# Altium project 擂台机器人.PrjPcb
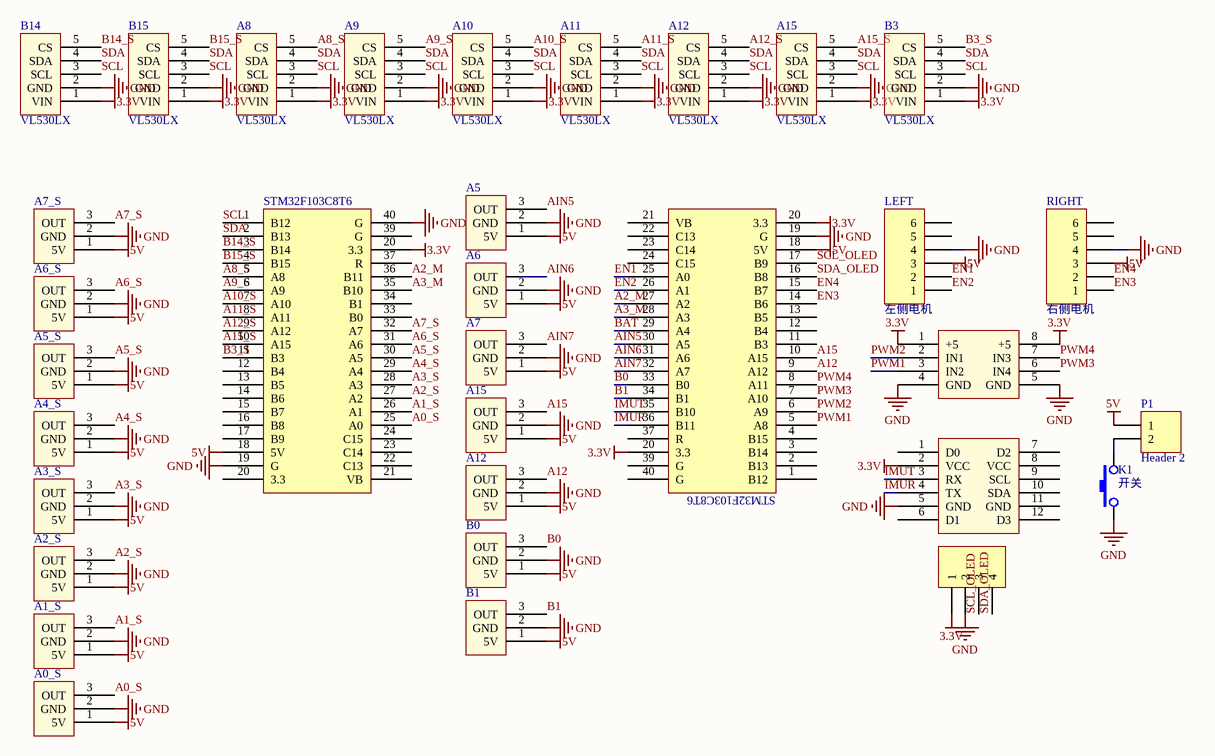
[diagram p0: 擂台机器人.SchDoc]
1 sheet, 33 parts. Net scope: global (net labels, ports and power ports of the same name join across sheets).
Board files: 擂台机器人V1.0.PcbDoc, PCB1.PcbDoc

## Sheet 擂台机器人.SchDoc
size A4

### Parts
(Parts that share a designator on the sheet are numbered #1, #2 ... from top to bottom, then left to right.)
A0_S  通用3PIN接线端子  [通用3pin插座]  (value not drawn)
A1_S  通用3PIN接线端子  [通用3pin插座]  (value not drawn)
A2_S  通用3PIN接线端子  [通用3pin插座]  (value not drawn)
A3_S  通用3PIN接线端子  [通用3pin插座]  (value not drawn)
A4_S  通用3PIN接线端子  [通用3pin插座]  (value not drawn)
A5  通用3PIN接线端子  [通用3pin插座]  (value not drawn)
A5_S  通用3PIN接线端子  [通用3pin插座]  (value not drawn)
A6  通用3PIN接线端子  [通用3pin插座]  (value not drawn)
A6_S  通用3PIN接线端子  [通用3pin插座]  (value not drawn)
A7  通用3PIN接线端子  [通用3pin插座]  (value not drawn)
A7_S  通用3PIN接线端子  [通用3pin插座]  (value not drawn)
A8  VL530LX  [VL53L0X]
A9  VL530LX  [VL53L0X]
A10  VL530LX  [VL53L0X]
A11  VL530LX  [VL53L0X]
A12#1  VL530LX  [VL53L0X]
A12#2  通用3PIN接线端子  [通用3pin插座]  (value not drawn)
A15#1  VL530LX  [VL53L0X]
A15#2  通用3PIN接线端子  [通用3pin插座]  (value not drawn)
B0  通用3PIN接线端子  [通用3pin插座]  (value not drawn)
B1  通用3PIN接线端子  [通用3pin插座]  (value not drawn)
B3  VL530LX  [VL53L0X]
B14  VL530LX  [VL53L0X]
B15  VL530LX  [VL53L0X]
C8T6最小系统  C8T6最小系统  [C8t6]  (value not drawn)
C8T6最小系统2  C8T6最小系统  [C8t6]  (value not drawn)
K1  开关  [船型开关 KCD1-11-2P]
LEFT  左侧电机  [HDR1X6]
OLED  OLED  [HDR1X4]  (value not drawn)
P1  Header 2  [接线端子 2]
RIGHT  右侧电机  [HDR1X6]
WT901  WT901  [WT901]  (value not drawn)
得科电机驱动  得科电机驱动  [得科电机驱动]  (value not drawn)

### Nets
3.3V: A8.1(VIN) A9.1(VIN) A10.1(VIN) A11.1(VIN) A12#1.1(VIN) A15#1.1(VIN) B3.1(VIN) B14.1(VIN) B15.1(VIN) C8T6最小系统.20(3.3) C8T6最小系统2.20(3.3) OLED.1 WT901.2(VCC) 得科电机驱动.1(+5) 得科电机驱动.8(+5)
5V: A0_S.1(5V) A1_S.1(5V) A2_S.1(5V) A3_S.1(5V) A4_S.1(5V) A5.1(5V) A5_S.1(5V) A6.1(5V) A6_S.1(5V) A7.1(5V) A7_S.1(5V) A12#2.1(5V) A15#2.1(5V) B0.1(5V) B1.1(5V) C8T6最小系统.18(5V) C8T6最小系统2.18(5V) LEFT.3 P1.1 RIGHT.3
GND: A0_S.2(GND) A1_S.2(GND) A2_S.2(GND) A3_S.2(GND) A4_S.2(GND) A5.2(GND) A5_S.2(GND) A6.2(GND) A6_S.2(GND) A7.2(GND) A7_S.2(GND) A8.2(GND) A9.2(GND) A10.2(GND) A11.2(GND) A12#1.2(GND) A12#2.2(GND) A15#1.2(GND) A15#2.2(GND) B0.2(GND) B1.2(GND) B3.2(GND) B14.2(GND) B15.2(GND) C8T6最小系统.19(G) C8T6最小系统2.19(G) C8T6最小系统2.40(G) K1.1 LEFT.4 OLED.2 RIGHT.4 WT901.5(GND) 得科电机驱动.4(GND) 得科电机驱动.5(GND)
A0_S: A0_S.3(OUT) C8T6最小系统2.25(A0)
A1_S: A1_S.3(OUT) C8T6最小系统2.26(A1)
A2_M: C8T6最小系统.27(A2) C8T6最小系统2.36(B11)
A2_S: A2_S.3(OUT) C8T6最小系统2.27(A2)
A3_M: C8T6最小系统.28(A3) C8T6最小系统2.35(B10)
A3_S: A3_S.3(OUT) C8T6最小系统2.28(A3)
A4_S: A4_S.3(OUT) C8T6最小系统2.29(A4)
A5_S: A5_S.3(OUT) C8T6最小系统2.30(A5)
A6_S: A6_S.3(OUT) C8T6最小系统2.31(A6)
A7_S: A7_S.3(OUT) C8T6最小系统2.32(A7)
A8_S: A8.5(CS) C8T6最小系统2.5(A8)
A9_S: A9.5(CS) C8T6最小系统2.6(A9)
A10_S: A10.5(CS) C8T6最小系统2.7(A10)
A11_S: A11.5(CS) C8T6最小系统2.8(A11)
A12: A12#2.3(OUT) C8T6最小系统.9(A12)
A12_S: A12#1.5(CS) C8T6最小系统2.9(A12)
A15: A15#2.3(OUT) C8T6最小系统.10(A15)
A15_S: A15#1.5(CS) C8T6最小系统2.10(A15)
AIN5: A5.3(OUT) C8T6最小系统.30(A5)
AIN6: A6.3(OUT) C8T6最小系统.31(A6)
AIN7: A7.3(OUT) C8T6最小系统.32(A7)
B0: B0.3(OUT) C8T6最小系统.33(B0)
B1: B1.3(OUT) C8T6最小系统.34(B1)
B3_S: B3.5(CS) C8T6最小系统2.11(B3)
B14_S: B14.5(CS) C8T6最小系统2.3(B14)
B15_S: B15.5(CS) C8T6最小系统2.4(B15)
BAT: C8T6最小系统.29(A4)
EN1: C8T6最小系统.25(A0) LEFT.2
EN2: C8T6最小系统.26(A1) LEFT.1
EN3: C8T6最小系统.14(B6) RIGHT.1
EN4: C8T6最小系统.15(B7) RIGHT.2
IMUR: C8T6最小系统.36(B11) WT901.4(TX)
IMUT: C8T6最小系统.35(B10) WT901.3(RX)
PWM1: C8T6最小系统.5(A8) 得科电机驱动.3(IN2)
PWM2: C8T6最小系统.6(A9) 得科电机驱动.2(IN1)
PWM3: C8T6最小系统.7(A10) 得科电机驱动.6(IN4)
PWM4: C8T6最小系统.8(A11) 得科电机驱动.7(IN3)
SCL: A8.3(SCL) A9.3(SCL) A10.3(SCL) A11.3(SCL) A12#1.3(SCL) A15#1.3(SCL) B3.3(SCL) B14.3(SCL) B15.3(SCL) C8T6最小系统2.1(B12)
SCL_OLED: C8T6最小系统.17(B9) OLED.3
SDA: A8.4(SDA) A9.4(SDA) A10.4(SDA) A11.4(SDA) A12#1.4(SDA) A15#1.4(SDA) B3.4(SDA) B14.4(SDA) B15.4(SDA) C8T6最小系统2.2(B13)
SDA_OLED: C8T6最小系统.16(B8) OLED.4
NetK1_2: K1.2 P1.2

Not connected (* = marked no-connect by the designer): C8T6最小系统 1(B12) 2(B13) 3(B14) 4(B15) 11(B3) 12(B4) 13(B5) 21(VB) 22(C13) 23(C14) 24(C15) 37(R) 39(G) 40(G); C8T6最小系统2 12(B4) 13(B5) 14(B6) 15(B7) 16(B8) 17(B9) 21(VB) 22(C13) 23(C14) 24(C15) 33(B0) 34(B1) 37(R) 39(G); LEFT 5 6; RIGHT 5 6; WT901 1(D0) 6(D1) 7(D2) 8(VCC) 9(SCL) 10(SDA) 11(GND) 12(D3)

### Notes on the sheet
- (in symbol C8T6最小系统) STM32F103C8T6

### Library data of the parts
LEFT RIGHT = Header 6: Header, 6-Pin; LatestRevisionDate: 17-Jul-2002; LatestRevisionNote: Re-released for DXP Platform.; Publisher: Altium Limited
OLED = Header 4: Header, 4-Pin; LatestRevisionDate: 17-Jul-2002; LatestRevisionNote: Re-released for DXP Platform.; Publisher: Altium Limited
P1 = Header 2: Header, 2-Pin; LatestRevisionDate: 17-Jul-2002; LatestRevisionNote: Re-released for DXP Platform.; Publisher: Altium Limited